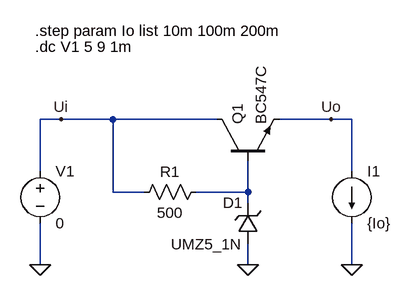
[diagram p0: schematic regulator_zener_bjt.asc]
regulator_zener_bjt.asc, the LTspice schematic file:
Version 4.1
SHEET 1 880 680
WIRE 0 96 -32 96
WIRE 80 96 0 96
WIRE 240 96 80 96
WIRE 416 96 336 96
WIRE 448 96 416 96
WIRE -32 176 -32 96
WIRE 448 176 448 96
WIRE 80 208 80 96
WIRE 128 208 80 208
WIRE 288 208 288 160
WIRE 288 208 208 208
WIRE 288 224 288 208
WIRE -32 320 -32 256
WIRE 288 320 288 288
WIRE 448 320 448 256
FLAG -32 320 0
FLAG 288 320 0
FLAG 448 320 0
FLAG 0 96 Ui
FLAG 416 96 Uo
SYMBOL res 224 192 R90
WINDOW 0 0 56 VBottom 2
WINDOW 3 32 56 VTop 2
SYMATTR InstName R1
SYMATTR Value 500
SYMBOL zener 304 288 R180
WINDOW 0 24 64 Left 2
WINDOW 3 24 0 Left 2
SYMATTR InstName D1
SYMATTR Value UMZ5_1N
SYMBOL voltage -32 160 R0
WINDOW 123 0 0 Left 0
WINDOW 39 0 0 Left 0
SYMATTR InstName V1
SYMATTR Value 0
SYMBOL current 448 176 R0
WINDOW 123 0 0 Left 0
WINDOW 39 0 0 Left 0
SYMATTR InstName I1
SYMATTR Value {Io}
SYMBOL npn 240 160 R270
SYMATTR InstName Q1
SYMATTR Value BC547C
TEXT -40 -16 Left 2 !.dc V1 5 9 1m
TEXT -40 -40 Left 2 !.step param Io list 10m 100m 200m

The netlist it stands for:
* regulator_zener_bjt.asc
R1 N001 Ui 500
D1 0 N001 UMZ5_1N
V1 Ui 0 0
I1 Uo 0 {Io}
Q1 Ui N001 Uo 0 BC547C
.model D D
.lib standard.dio
.model NPN NPN
.model PNP PNP
.lib standard.bjt
.dc V1 5 9 1m
.step param Io list 10m 100m 200m
.backanno
.end